# Altium project 剥皮器20200624.PrjPCB
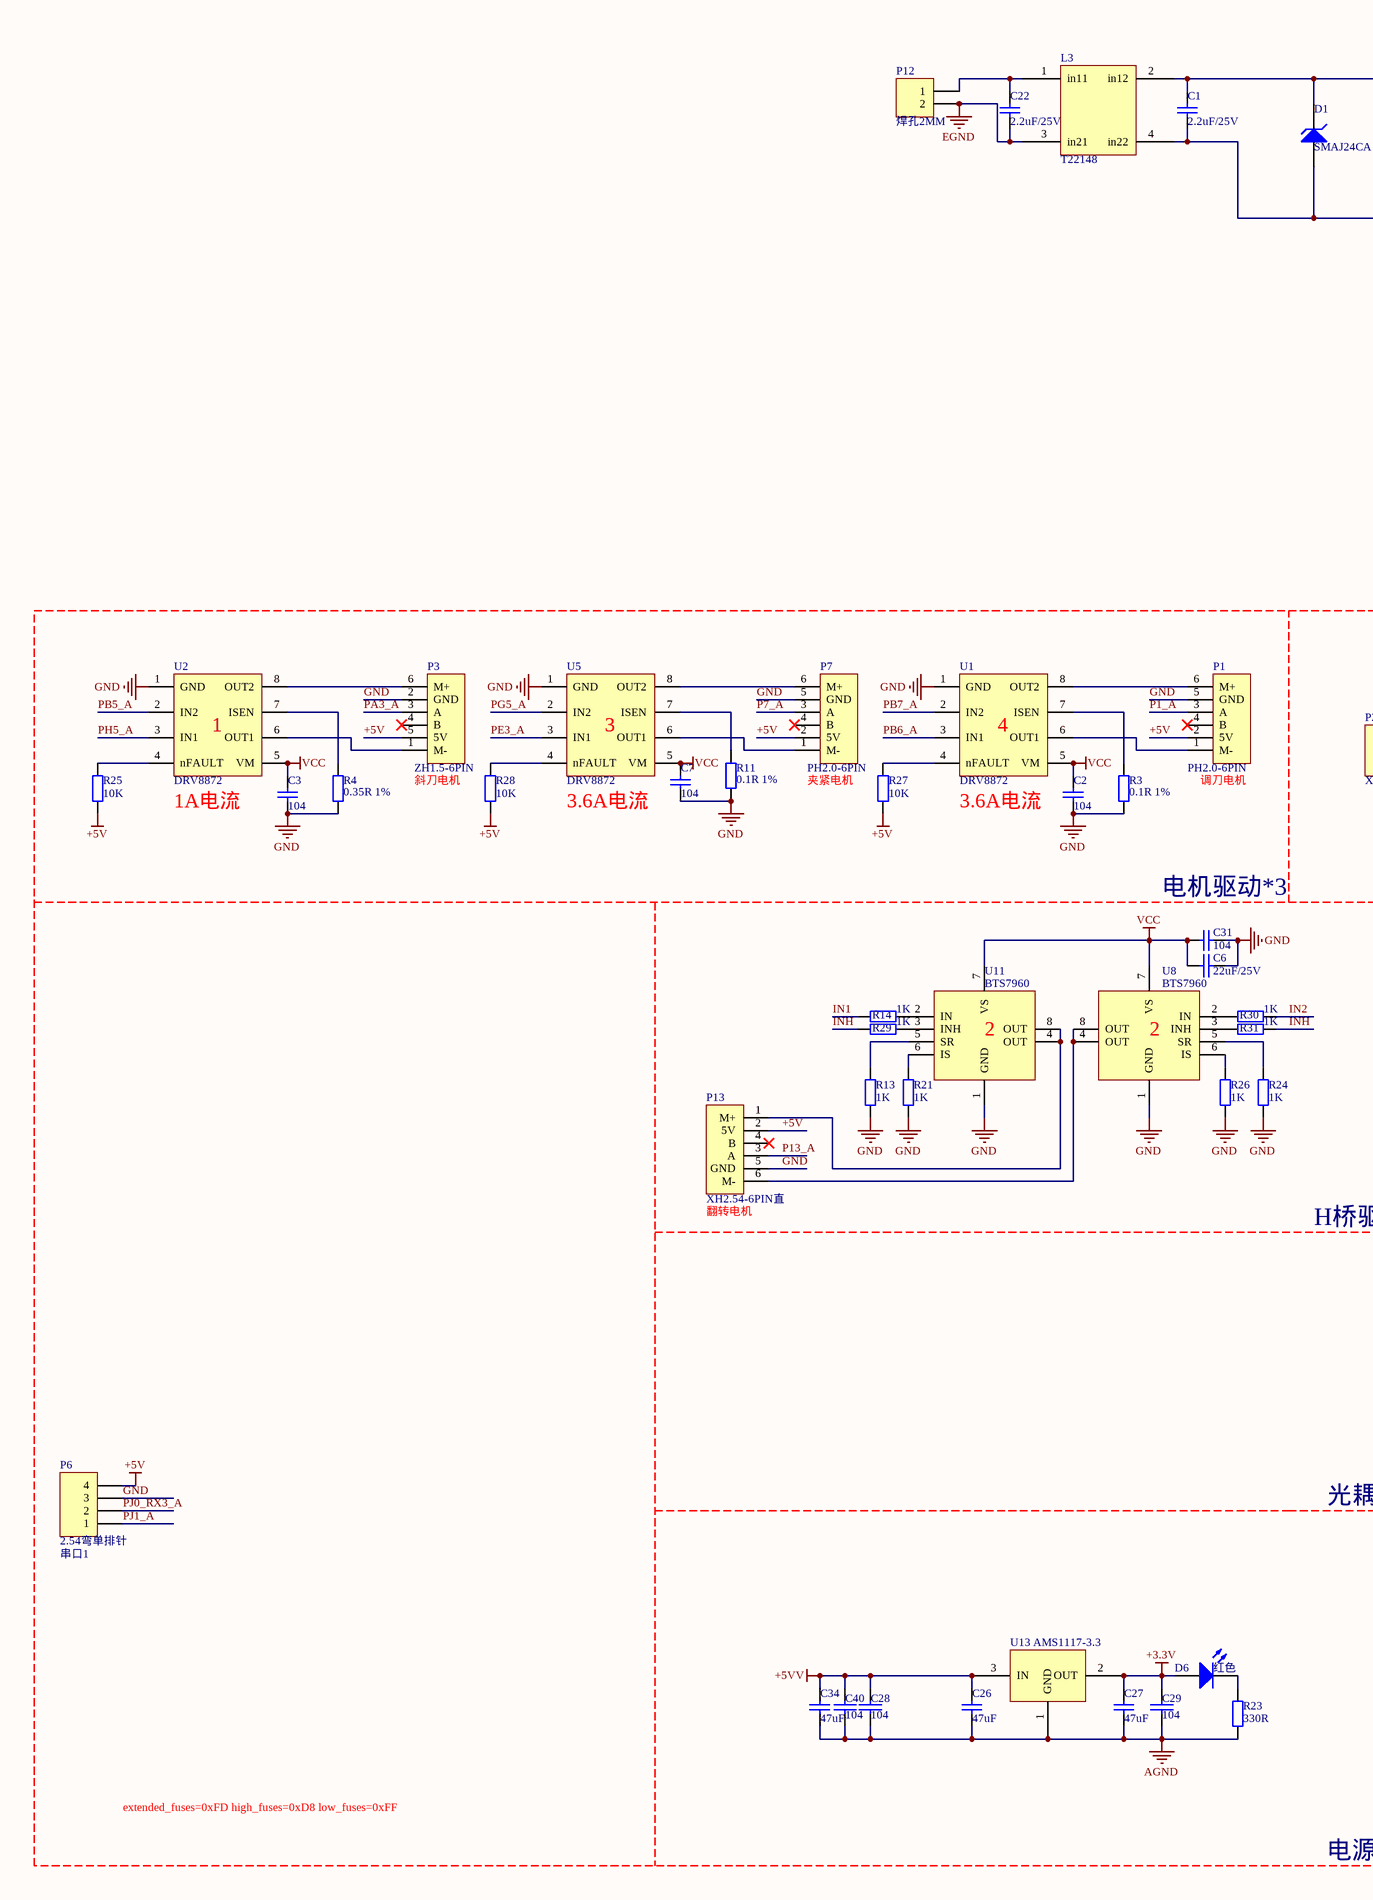
[diagram p0: 剥皮器20200614.SCHDOC, left]
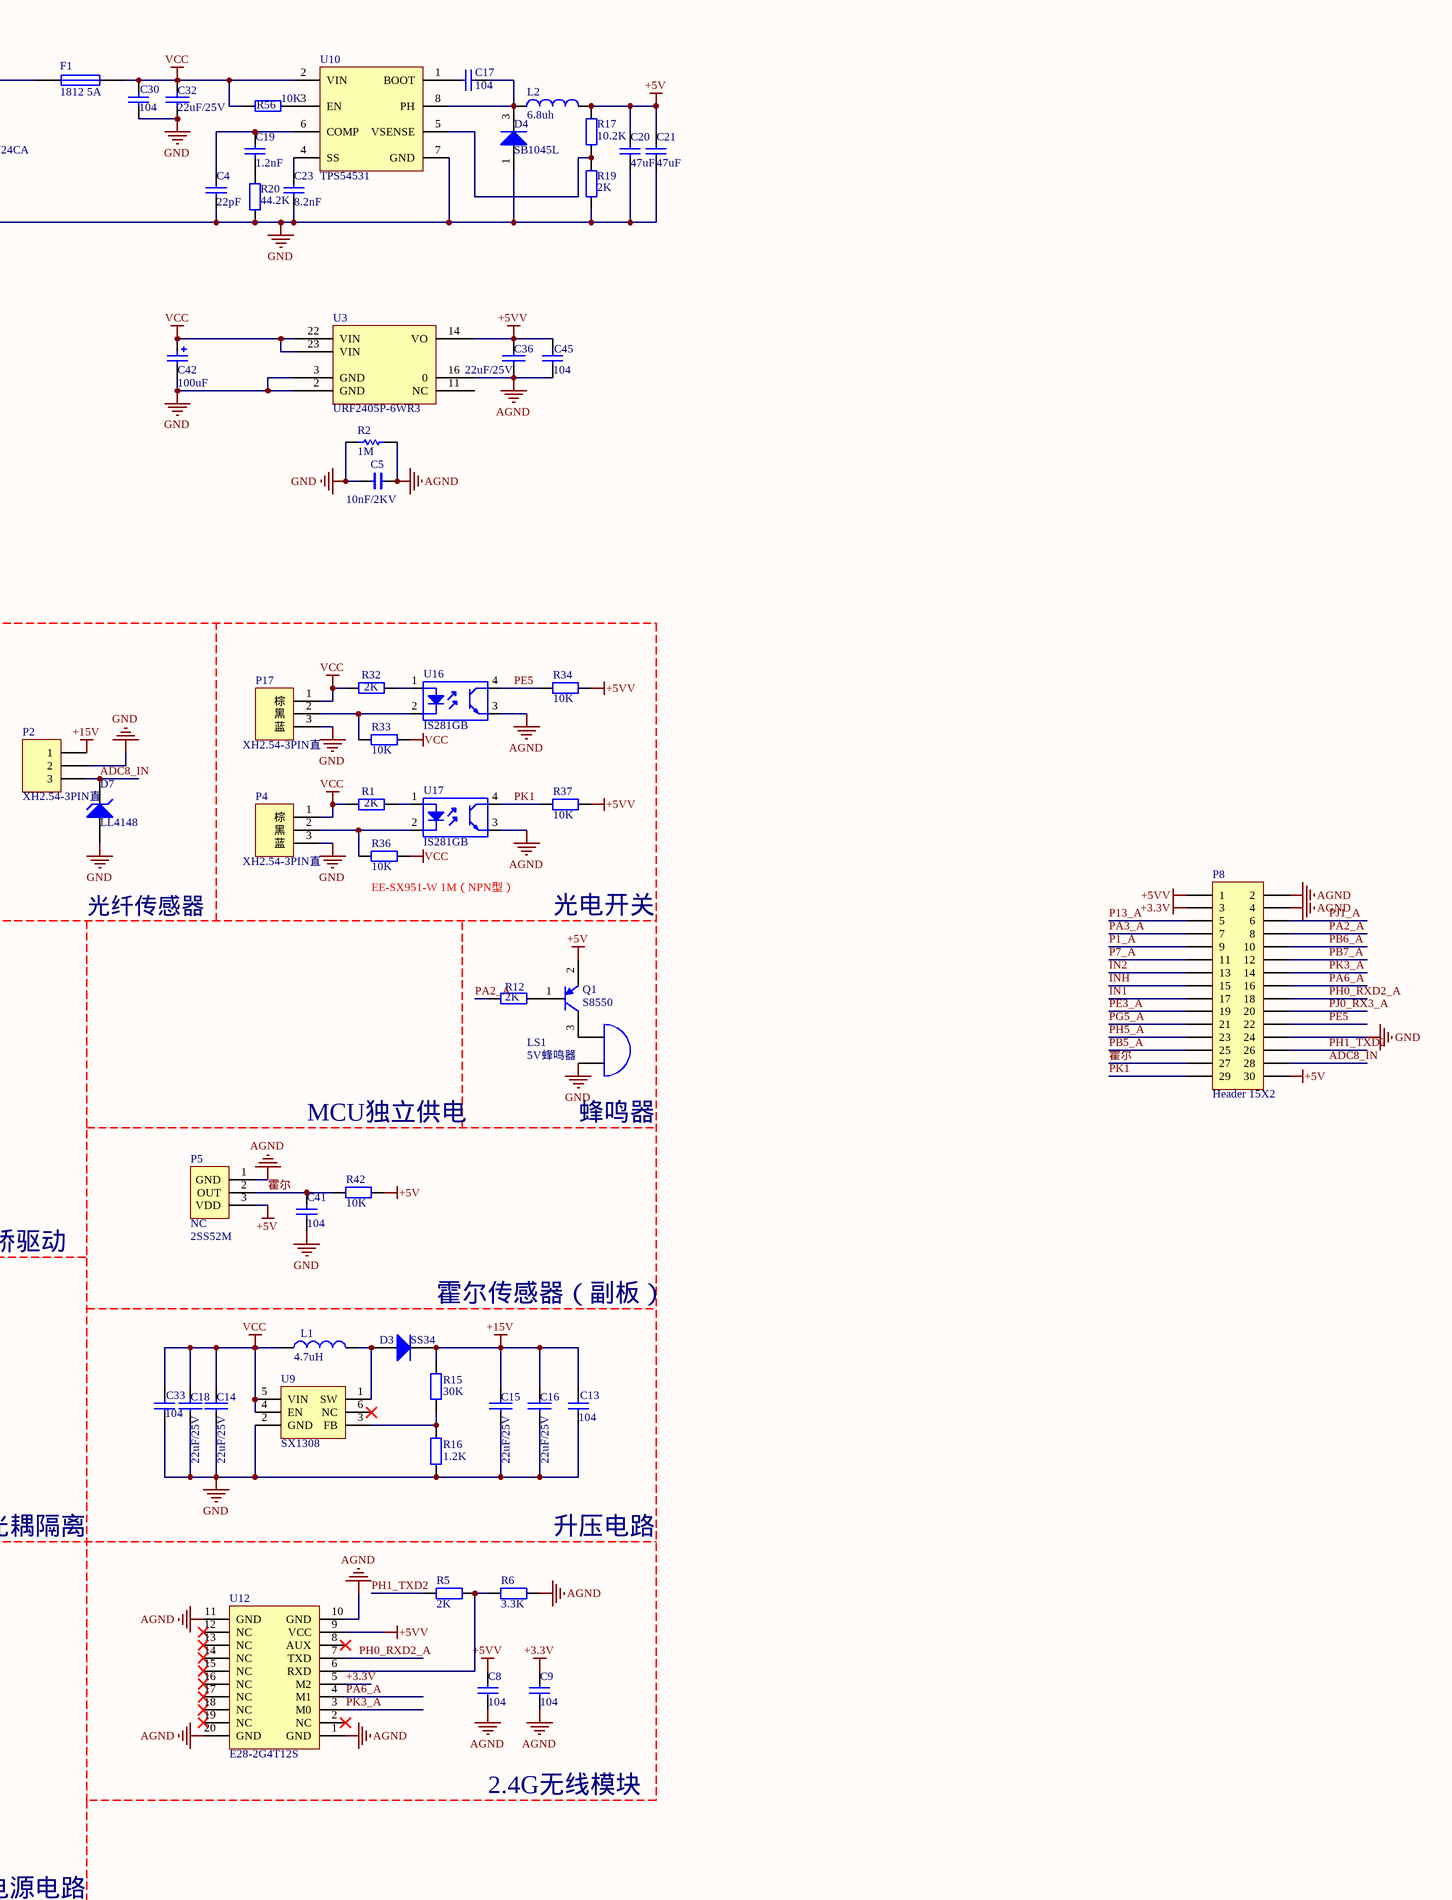
[diagram p1: 剥皮器20200614.SCHDOC, right]
1 sheet, 100 parts. Net scope: global (net labels, ports and power ports of the same name join across sheets).
Board file: 剥皮器20200614.PCBDOC

## Sheet 剥皮器20200614.SCHDOC
size A2; PageSetup: Record=PageOptions|CenterHorizontal=True|CenterVertical=True|PrintScale=1.02|XCorrection=1.00|YCorrection=1.00|PrintKind=0|BorderSize=5000000|LeftOffset=0|BottomOffset=0|Orientation=2|PaperLength=1000|PaperWidth=1000|Scale=100|PaperSource=7|PrintQuality=-4|MediaType=1|DitherType=10|PaperKind=A3|PrintScaleMode=1

### Parts
C1  2.2uF/25V  [0805-C]
C2  104  [0805-C]
C3  104  [0805-C]
C4  22pF  [0805-C]
C5  10nF/2KV  [1206C]
C6  22uF/25V  [1206C]
C7  104  [0805-C]
C8  104  [0805-C]
C9  104  [0805-C]
C13  104  [0805-C]
C14  22uF/25V  [1206-C]
C15  22uF/25V  [1206-C]
C16  22uF/25V  [1206-C]
C17  104  [0805-C]
C18  22uF/25V  [1206-C]
C19  1.2nF  [0805-C]
C20  47uF  [0805-C]
C21  47uF  [0805-C]
C22  2.2uF/25V  [0805-C]
C23  8.2nF  [0805-C]
C26  47uF  [0805-C]
C27  47uF  [0805-C]
C28  104  [0805-C]
C29  104  [0805-C]
C30  104  [0805-C]
C31  104  [0805-C]
C32  22uF/25V  [1206-C]
C33  104  [0805-C]
C34  47uF  [0805-C]
C36  22uF/25V  [1206-C]
C40  104  [0805-C]
C41  104  [0805-C]
C42  100uF  [LC-CASE-C_6032]
C45  104  [0805-C]
D1  SMAJ24CA  [sma]
D3  SS34  [SMA - JW]
D4  SB1045L  [TO-277]
D6  红色  [0805-LED]
D7  LL4148  [LC-LL-34]
F1  1812 5A  [LC-1812_R]
L1  4.7uH  [7*7*4电感]
L2  6.8uh  [7*7*4电感]
L3  T22148  [T181007]
LS1  5V蜂鸣器  [蜂鸣器0905]
P1  PH2.0-6PIN  [PH2.0-6PIN]
P2  XH2.54-3PIN直  [XH2.54-3PIN直]
P3  ZH1.5-6PIN  [ZH1.5-6PIN]
P4  XH2.54-3PIN直  [XH2.54-3PIN直]
P5  NC  [2SS52M]
P6  2.54弯单排针  [HDR1X4H]
P7  PH2.0-6PIN  [PH2.0-6PIN]
P8  Header 15X2  [SIP15-1.27]
P12  焊孔2MM  [HDR1X2]
P13  XH2.54-6PIN直  [XH2.54-6PIN直]
P17  XH2.54-3PIN直  [XH2.54-3PIN直]
Q1  S8550  [SOT--23]
R1  2K  [0805-R]
R2  1M  [2512R]
R3  0.1R 1%  [2512-R]
R4  0.35R 1%  [2512-R]
R5  2K  [0805-R]
R6  3.3K  [0805-R]
R11  0.1R 1%  [2512-R]
R12  2K  [0805-R]
R13  1K  [0805-R]
R14  1K  [0805-R]
R15  30K  [0805-R]
R16  1.2K  [0805-R]
R17  10.2K  [0805-R]
R19  2K  [0805-R]
R20  44.2K  [0805-R]
R21  1K  [0805-R]
R23  330R  [0805-R]
R24  1K  [0805-R]
R25  10K  [0805-R]
R26  1K  [0805-R]
R27  10K  [0805-R]
R28  10K  [0805-R]
R29  1K  [0805-R]
R30  1K  [0805-R]
R31  1K  [0805-R]
R32  2K  [0805-R]
R33  10K  [0805-R]
R34  10K  [0805-R]
R36  10K  [0805-R]
R37  10K  [0805-R]
R42  10K  [0805-R]
R56  10K  [0805-R]
U1  DRV8872  [SOP-8带散热]
U2  DRV8872  [SOP-8带散热]
U3  URF2405P-6WR3  [URF2405P-6WR3]
U5  DRV8872  [SOP-8带散热]
U8  BTS7960  [LC-TO-263-7]
U9  SX1308  [SOT-23-6]
U10  TPS54531  [SOP-8带散热]
U11  BTS7960  [LC-TO-263-7]
U12  E28-2G4T12S  [E28-2G4T12S]
U13  AMS1117-3.3  [SOT--223]
U16  IS281GB  [LC-SOP-4_P1.27]
U17  IS281GB  [LC-SOP-4_P1.27]

### Nets
+3.3V: C9.1 C27.2 C29.1 D6.1(A) P8.3 U12.5(M2) U13.2(OUT)
+5V: C20.2 C21.2 L2.2 P1.2(5V) P3.5(5V) P5.3(VDD) P6.4 P7.2(5V) P8.30 P13.2(5V) Q1.2(E) R17.2 R25.1 R27.1 R28.1 R42.1
+5VV: C8.1 C26.2 C28.1 C34.2 C36.1 C40.1 C45.2 P8.1 R34.2 R37.2 U3.14(VO) U12.9(VCC) U13.3(IN)
+15V: C13.1 C15.1 C16.1 D3.2(K) P2.1 R15.1
AGND: C5.1 C8.2 C9.2 C26.1 C27.1 C28.2 C29.2 C34.1 C36.2 C40.2 C45.1 P5.1(GND) P8.2 P8.4 R2.1 R6.2 R23.2 U3.16(0) U12.1(GND) U12.10(GND) U12.11(GND) U12.20(GND) U13.1(GND) U16.3 U17.3
EGND: C22.2 L3.3(in21) P12.2
GND: C1.2 C2.2 C3.2 C4.2 C5.2 C6.2 C7.2 C13.2 C14.2 C15.2 C16.2 C18.2 C20.1 C21.1 C23.2 C30.1 C31.2 C32.2 C33.1 C41.2 C42.2 D1.1(A) D4.1(A) D7.1(A) L3.4(in22) LS1.2(B) P1.5(GND) P2.2 P3.2(GND) P4.3(蓝) P6.3 P7.5(GND) P8.24 P13.5(GND) P17.3(蓝) R2.2 R3.1 R4.1 R11.1 R13.1 R16.2 R19.1 R20.1 R21.1 R24.1 R26.1 U1.1(GND) U2.1(GND) U3.2(GND) U3.3(GND) U5.1(GND) U8.1(GND) U9.2(GND) U10.7(GND) U11.1(GND)
VCC: C2.1 C3.1 C6.1 C7.1 C14.1 C18.1 C30.2 C31.1 C32.1 C33.2 C42.1 F1.1 L1.1 P4.1(棕) P17.1(棕) R1.1 R32.1 R33.1 R36.1 R56.2 U1.5(VM) U2.5(VM) U3.22(VIN) U3.23(VIN) U5.5(VM) U8.7(VS) U9.4(EN) U9.5(VIN) U10.2(VIN) U11.7(VS)
ADC8_IN: D7.2(K) P2.3 P8.28
IN1: P8.17 R14.2
IN2: P8.13 R30.1
INH: P8.15 R29.2 R31.1
P1_A: P1.3(A) P8.9
P7_A: P7.3(A) P8.11
P13_A: P8.5 P13.3(A)
PA2_A: P8.8 R12.2
PA3_A: P3.3(A) P8.7
PA6_A: P8.16 U12.4(M1)
PB5_A: P8.25 U2.2(IN2)
PB6_A: P8.10 U1.3(IN1)
PB7_A: P8.12 U1.2(IN2)
PE3_A: P8.19 U5.3(IN1)
PE5: P8.22 R34.1 U16.4
PG5_A: P8.21 U5.2(IN2)
PH0_RXD2_A: P8.18 U12.7(TXD)
PH1_TXD2: P8.26 R5.1
PH5_A: P8.23 U2.3(IN1)
PJ0_RX3_A: P6.2 P8.20
PJ1_A: P6.1 P8.6
PK1: P8.29 R37.1 U17.4
PK3_A: P8.14 U12.3(M0)
霍尔: C41.1 P5.2(OUT) P8.27 R42.2
NetC1_1: C1.1 D1.2(K) F1.2 L3.2(in12)
NetC4_1: C4.1 C19.1 U10.6(COMP)
NetC17_1: C17.1 U10.1(BOOT)
NetC17_2: C17.2 D4.3(K) L2.1 U10.8(PH)
NetC19_2: C19.2 R20.2
NetC22_1: C22.1 L3.1(in11) P12.1
NetC23_1: C23.1 U10.4(SS)
NetD3_1: D3.1(A) L1.2 U9.1(SW)
NetD6_2: D6.2(K) R23.1
NetLS1_1: LS1.1(A) Q1.3(C)
NetP1_1: P1.1(M-) U1.6(OUT1)
NetP1_6: P1.6(M+) U1.8(OUT2)
NetP3_1: P3.1(M-) U2.6(OUT1)
NetP3_6: P3.6(M+) U2.8(OUT2)
NetP4_2: P4.2(黑) R36.2 U17.2
NetP7_1: P7.1(M-) U5.6(OUT1)
NetP7_6: P7.6(M+) U5.8(OUT2)
NetP13_1: P13.1(M+) U11.4(OUT) U11.8(OUT)
NetP13_6: P13.6(M-) U8.4(OUT) U8.8(OUT)
NetP17_2: P17.2(黑) R33.2 U16.2
NetQ1_1: Q1.1(B) R12.1
NetR1_2: R1.2 U17.1
NetR3_2: R3.2 U1.7(ISEN)
NetR4_2: R4.2 U2.7(ISEN)
NetR5_2: R5.2 R6.1 U12.6(RXD)
NetR11_2: R11.2 U5.7(ISEN)
NetR13_2: R13.2 U11.5(SR)
NetR14_1: R14.1 U11.2(IN)
NetR15_2: R15.2 R16.1 U9.3(FB)
NetR17_1: R17.1 R19.2 U10.5(VSENSE)
NetR21_2: R21.2 U11.6(IS)
NetR24_2: R24.2 U8.5(SR)
NetR25_2: R25.2 U2.4(nFAULT)
NetR26_2: R26.2 U8.6(IS)
NetR27_2: R27.2 U1.4(nFAULT)
NetR28_2: R28.2 U5.4(nFAULT)
NetR29_1: R29.1 U11.3(INH)
NetR30_2: R30.2 U8.2(IN)
NetR31_2: R31.2 U8.3(INH)
NetR32_2: R32.2 U16.1
NetR56_1: R56.1 U10.3(EN)

Not connected (* = marked no-connect by the designer): P1 4(B)*; P3 4(B)*; P7 4(B)*; P13 4(B)*; U3 11(NC); U9 6(NC)*; U12 2(NC)* 8(AUX)* 12(NC)* 13(NC)* 14(NC)* 15(NC)* 16(NC)* 17(NC)* 18(NC)* 19(NC)*

### Notes on the sheet
- (near U2) 1
- (near P3) 斜刀电机
- (near U5) 3
- (near P7) 夹紧电机
- (near U1) 4
- (near P1) 调刀电机
- (near U2) 1A电流
- (near U5) 3.6A电流
- (near U1) 3.6A电流
- (near C31) 电机驱动*3
- 光纤传感器
- (near R36) EE-SX951-W 1M（NPN型）
- 光电开关
- (near U11) 2
- (near U8) 2
- MCU独立供电
- (near LS1) 蜂鸣器
- (near P13) 翻转电机
- H桥驱动
- 霍尔传感器（副板）
- 光耦隔离
- 升压电路
- 2.4G无线模块
- extended_fuses=0xFD high_fuses=0xD8 low_fuses=0xFF
- 电源电路
- (in symbol Header 4) 串口1

### Library data of the parts
C1-C4 C7-C9 C13 C17 C19-C23 C26 C27 C30 C31 C33 C34 C41 C45 = Cap: Capacitor; Published: 8-Jun-2000; LatestRevisionDate: 17-Jul-2002; LatestRevisionNote: Re-released for DXP Platform.; PackageReference: RAD-0.3; Publisher: Altium Limited
  C13: Value: 104
C5 = C
C6 C14-C16 C18 C28 C29 C32 C36 C40 = CAP: Capacitor
C42 = Cap Pol2: Polarized Capacitor (Axial); Value: 100pF; Published: 8-Jun-2000; LatestRevisionDate: 17-Jul-2002; LatestRevisionNote: Re-released for DXP Platform.; PackageReference: POLAR0.8; Publisher: Altium Limited
D1 D7 = D Zener: Zener Diode; Published: 8-Jun-2000; LatestRevisionDate: 17-Jul-2002; LatestRevisionNote: Re-released for DXP Platform.; PackageReference: DIODE-0.7; Publisher: Altium Limited
D3 = Diode 1N4007: 1 Amp General Purpose Rectifier; Published: 8-Jun-2000; LatestRevisionDate: 17-Jul-2002; LatestRevisionNote: Re-released for DXP Platform.; DatasheetDocument: 1998; PackageDocument: Aug-1999; PackageReference: DO-41; Publisher: Altium Limited; Code_JEDEC: DO-204-AL; ComponentLink1Description: Manufacturer Link; ComponentLink1URL: http://www.fairchildsemi.com/; ComponentLink2Description: Datasheet; ComponentLink2URL: http://www.fairchildsemi.com/ds/1N%2F1N4001.pdf
D4 = Diode 1N4001: 1 Amp General Purpose Rectifier; Published: 8-Jun-2000; LatestRevisionDate: 17-Jul-2002; LatestRevisionNote: Re-released for DXP Platform.; DatasheetDocument: 1998; PackageDocument: Aug-1999; PackageReference: DO-41; Publisher: Altium Limited; Code_JEDEC: DO-204-AL; ComponentLink1Description: Manufacturer Link; ComponentLink1URL: http://www.fairchildsemi.com/; ComponentLink2Description: Datasheet; ComponentLink2URL: http://www.fairchildsemi.com/ds/1N%2F1N4001.pdf
D6 = LED0: Typical INFRARED GaAs LED; Published: 8-Jun-2000; LatestRevisionDate: 08-Jul-2005; LatestRevisionNote: Mech Layer 1 removed.; PackageReference: LED-0; Publisher: Altium Limited
F1 = Fuse 1: Fuse; Published: 8-Jun-2000; LatestRevisionDate: 17-Jul-2002; LatestRevisionNote: Re-released for DXP Platform.; PackageReference: PIN-W2/E2.8; Publisher: Altium Limited
L1 = Inductor: Code_IEC: 1005; Published: 8-Jun-2000; LatestRevisionDate: 17-Jul-2002; LatestRevisionNote: Re-released for DXP Platform.; PackageReference: 0402-A; Publisher: Altium Limited; Code_JEITA: 0402
L2 = Inductor: Code_IEC: 1005; Value: 10mH; Published: 8-Jun-2000; LatestRevisionDate: 17-Jul-2002; LatestRevisionNote: Re-released for DXP Platform.; PackageReference: 0402-A; Publisher: Altium Limited; Code_JEITA: 0402
L3 = 共模电感
LS1 = Bell: Electrical Bell; Published: 24-Mar-1999; LatestRevisionDate: 17-Jul-2002; LatestRevisionNote: Re-released for DXP Platform.; Publisher: Altium Limited
P1 P3 P7 P13 = Header 6: Header, 6-Pin; LatestRevisionDate: 17-Jul-2002; LatestRevisionNote: Re-released for DXP Platform.; Publisher: Altium Limited
P2 P4 P5 P17 = Header 3: Header, 3-Pin; LatestRevisionDate: 17-Jul-2002; LatestRevisionNote: Re-released for DXP Platform.
  P2 P4 P17: Publisher: Altium Limited
  P5: Publisher: 2SS52M
P6 = Header 4: Header, 4-Pin; LatestRevisionDate: 17-Jul-2002; LatestRevisionNote: Re-released for DXP Platform.; Publisher: Altium Limited
P8 = Header 15X2: Header, 15-Pin, Dual row; LatestRevisionDate: 17-Jul-2002; LatestRevisionNote: Re-released for DXP Platform.; Publisher: Altium Limited
P12 = Header 2: Header, 2-Pin; LatestRevisionDate: 17-Jul-2002; LatestRevisionNote: Re-released for DXP Platform.; Publisher: Altium Limited
Q1 = 2N3906: PNP General Purpose Amplifier; Published: 8-Jun-2000; LatestRevisionDate: 15-Jan-2003; LatestRevisionNote: PCB Footprint 'BCY-W3/D4.7' replaced; DatasheetDocument: 1997; PackageDocument: Sep-1998; PackageReference: TO-92A; Publisher: Altium Limited; Code_JEDEC: TO-92A; ComponentLink1Description: Manufacturer Link; ComponentLink1URL: http://www.fairchildsemi.com/; ComponentLink2Description: Datasheet; ComponentLink2URL: http://www.fairchildsemi.com/ds/2N%2F2N3906.pdf
R1 R5 R6 R12-R16 R21 R24 R26 R29-R32 R42 R56 = Res2: Resistor; Published: 8-Jun-2000; LatestRevisionDate: 17-Jul-2002; LatestRevisionNote: Re-released for DXP Platform.; PackageReference: AXIAL-0.4; Publisher: Altium Limited
  R1 R12 R32: Value: 2K
  R42: Value: 10K
R2 = Res1: Resistor; Published: 8-Jun-2000; LatestRevisionDate: 17-Jul-2002; LatestRevisionNote: Re-released for DXP Platform.; PackageReference: AXIAL-0.3; Publisher: Altium Limited
R3 R4 R11 R17 R19 R20 R23 = Res2: Resistor; Value: 10K; Published: 8-Jun-2000; LatestRevisionDate: 17-Jul-2002; LatestRevisionNote: Re-released for DXP Platform.; PackageReference: AXIAL-0.4; Publisher: Altium Limited
R25 R27 R28 = Res2: Resistor; Value: 47K; Published: 8-Jun-2000; LatestRevisionDate: 17-Jul-2002; LatestRevisionNote: Re-released for DXP Platform.; Publisher: Altium Limited
R33 R34 R36 R37 = Res2: Resistor; Value: 2K; Published: 8-Jun-2000; LatestRevisionDate: 17-Jul-2002; LatestRevisionNote: Re-released for DXP Platform.; PackageReference: AXIAL-0.4; Publisher: Altium Limited
U1 U2 U5 = 6N137
U12 = E43-433T13S
U13 = AS1117
U16 U17 = TLP521-1